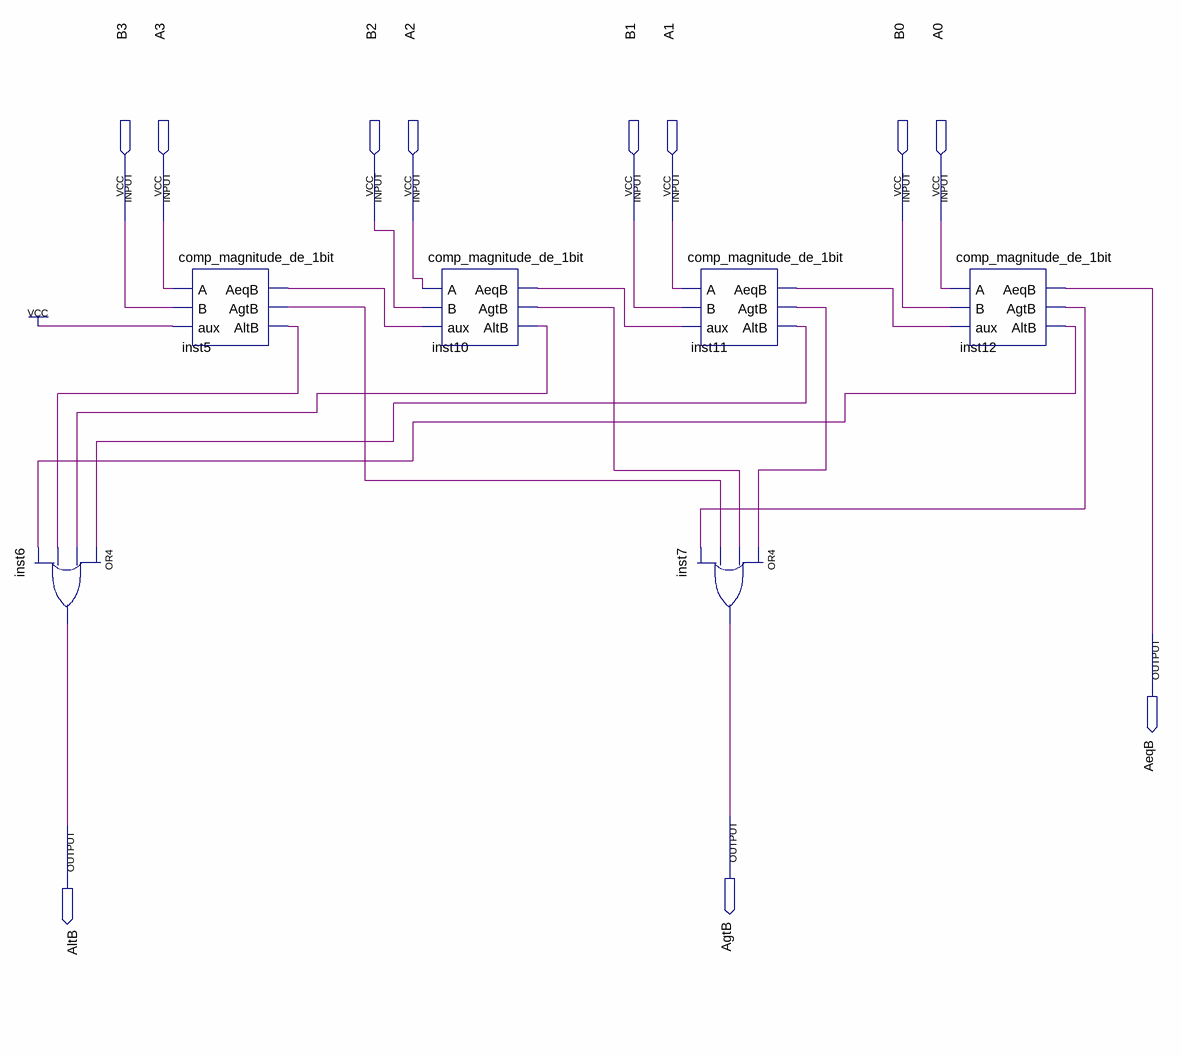
[diagram p0: schematic sheet]
// Quartus schematic comp_5bits.bdf as structural Verilog: 6 symbols, 11 pins
module comp_5bits (
  input  B3,
  input  A3,
  input  B2,
  input  A2,
  input  B1,
  input  A1,
  input  B0,
  input  A0,
  output AeqB,
  output AgtB,
  output AltB
);

  wire inst5_aeqb, inst5_agtb, inst5_altb, inst10_aeqb, inst10_agtb, inst10_altb, inst11_aeqb, inst11_agtb,
       inst11_altb, inst12_agtb, inst12_altb;

  or inst6 (AltB, inst11_altb, inst10_altb, inst5_altb, inst12_altb);
  comp_magnitude_de_1bit inst5 (.A(A3), .B(B3), .aux(1'b1), .AeqB(inst5_aeqb), .AgtB(inst5_agtb), .AltB(inst5_altb));
  comp_magnitude_de_1bit inst10 (
    .A(A2), .B(B2), .aux(inst5_aeqb), .AeqB(inst10_aeqb), .AgtB(inst10_agtb), .AltB(inst10_altb));
  comp_magnitude_de_1bit inst11 (
    .A(A1), .B(B1), .aux(inst10_aeqb), .AeqB(inst11_aeqb), .AgtB(inst11_agtb), .AltB(inst11_altb));
  or inst7 (AgtB, inst11_agtb, inst10_agtb, inst5_agtb, inst12_agtb);
  comp_magnitude_de_1bit inst12 (
    .A(A0), .B(B0), .aux(inst11_aeqb), .AeqB(AeqB), .AgtB(inst12_agtb), .AltB(inst12_altb));
endmodule
